# EAGLE design feedback_PCB (EAGLE 9.0.1)
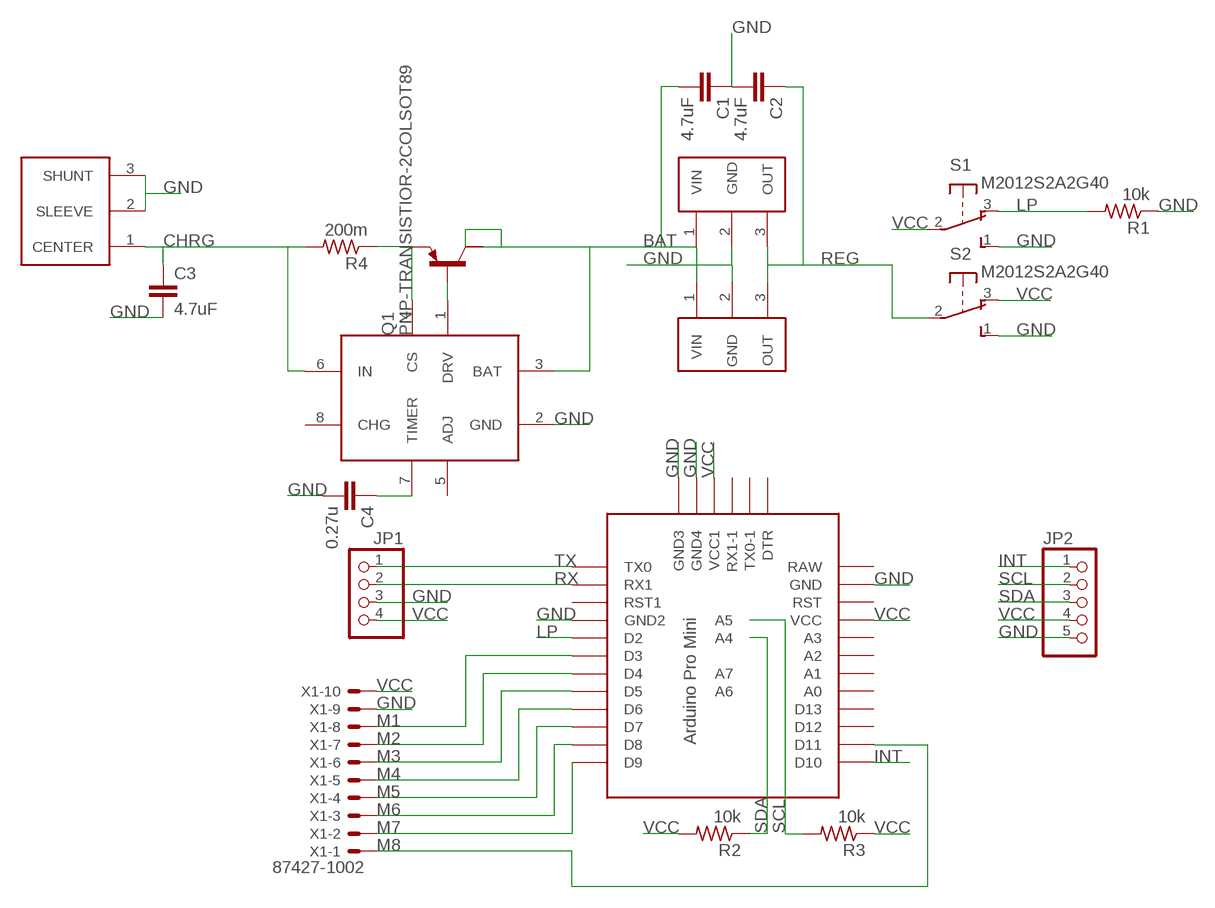
[diagram p0: schematic, sheet 1]

## Parts
C1  4.7uF  4.7UF0603  [0603]
C2  4.7uF  4.7UF0603  [0603]
C3  4.7uF  4.7UF0603  [0603]
C4  0.27u  0.33UF/330NF-0805-50V-10%  [0805]
JP1  PINHD-1X4  [1X04]
JP2  PINHD-1X5  [1X05]
Q1  PNP-TRANSISTIOR-2COLSOT89  [SOT89]
R1  10k  R-US_R0603  [R0603]
R2  10k  R-US_R0603  [R0603]
R3  10k  R-US_R0603  [R0603]
R4  200m  R-US_R0603  [R0603]
S1  M2012S2A2G40  [M2012S2A2G40]
S2  M2012S2A2G40  [M2012S2A2G40]
U2  ADP2291  [8-MSOP]
U$1  PRO-MINI-2  [PRO-MINI-2]
V1  UCC283T-3  [TO220V]
V2  UCC283T-3  [TO220V]
V3  L712RAS  [L712RAS]
X1  87427-1002  [87427-1002]

## Nets
BAT: C1.2 Q1.2(C) Q1.2@1(C/) U2.3(BAT) V1.1(VIN) V2.1(VIN)
CHRG: C3.1 R4.2 U2.6(IN) V3.1(CENTER)
CS: Q1.3(E) R4.1 U2.4(CS)
DRV: Q1.1(B) U2.1(DRV)
GND: C1.1 C2.2 C3.2 C4.2 JP1.3 JP2.5 R1.1 S1.1(S) S2.1(S) U2.2(GND) U$1.GND U$1.GND1(GND2) U$1.GND3(GND4) V1.2(GND) V2.2(GND) V3.2(SLEEVE) V3.3(SHUNT) X1.9
INT: JP2.1 U$1.D10
LP: R1.2 S1.3(O) U$1.D2
M1: U$1.D3 X1.8
M2: U$1.D4 X1.7
M3: U$1.D5 X1.6
M4: U$1.D6 X1.5
M5: U$1.D7 X1.4
M6: U$1.D8 X1.3
M7: U$1.D9 X1.2
M8: U$1.D11 X1.1
REG: C2.1 S2.2(P) V1.3(OUT) V2.3(OUT)
RX: JP1.2 U$1.RX1
SCL: JP2.2 R3.2 U$1.A5
SDA: JP2.3 R2.1 U$1.A4
TIMER: C4.1 U2.7(TIMER)
TX: JP1.1 U$1.TX0
VCC: JP1.4 JP2.4 R2.2 R3.1 S1.2(P) S2.3(O) U$1.VCC U$1.VCC1 X1.10
Unconnected: U2.5(ADJ) U2.8(CHG) U$1.A0 U$1.A1 U$1.A2 U$1.A3 U$1.A6 U$1.A7 U$1.D12 U$1.D13 U$1.DTR U$1.GND2(GND3) U$1.RAW U$1.RST U$1.RST1 U$1.RX1-1 U$1.TX0-1

## Library data of the parts
C1-C3 = SparkFun-Capacitors:4.7UF: 4.7µF ceramic capacitors A capacitor is a passive two-terminal electrical component used to store electrical energy temporarily in an electric field.; PROD_ID: CAP-08280
C4 = SparkFun-Capacitors:0.33UF/330NF: 0.33µF/330nF ceramic capacitors A capacitor is a passive two-terminal electrical component used to store electrical energy temporarily in an electric field.; PROD_ID: CAP-08469; VALUE: 0.33µF
JP1 = pinhead:PINHD-1X4: PIN HEADER
JP2 = pinhead:PINHD-1X5: PIN HEADER
Q1 = semicon-smd-ipc:PNP-TRANSISTIOR-2COL: PNP TRANSISTOR 2 colletor pins
R1-R4 = resistor:R-US_: RESISTOR, American symbol
S1 S2 = SeanSylwester:M2012S2A2G40: MARQUARDT SWITCH 9077.0100 Distributor: Buerklin <https://www.buerklin.com/default.asp?event=ShowArtikel%2812G2820%29&l=d&jump=ArtNr_12G2820>
U2 = SeanSylwester:ADP2291
U$1 = Arduino-clone:PRO-MINI-2: Arduino Pro Mini Layout 2 Sparkfun.com
V1 V2 = SeanSylwester:UCC283T-3
V3 = SeanSylwester:L712RAS
X1 = SeanSylwester:87427-1002: Mini FIT connector 10 pol Source: http://www.molex.com; MF: MOLEX; OC_FARNELL: unknown; OC_NEWARK: unknown

## Board
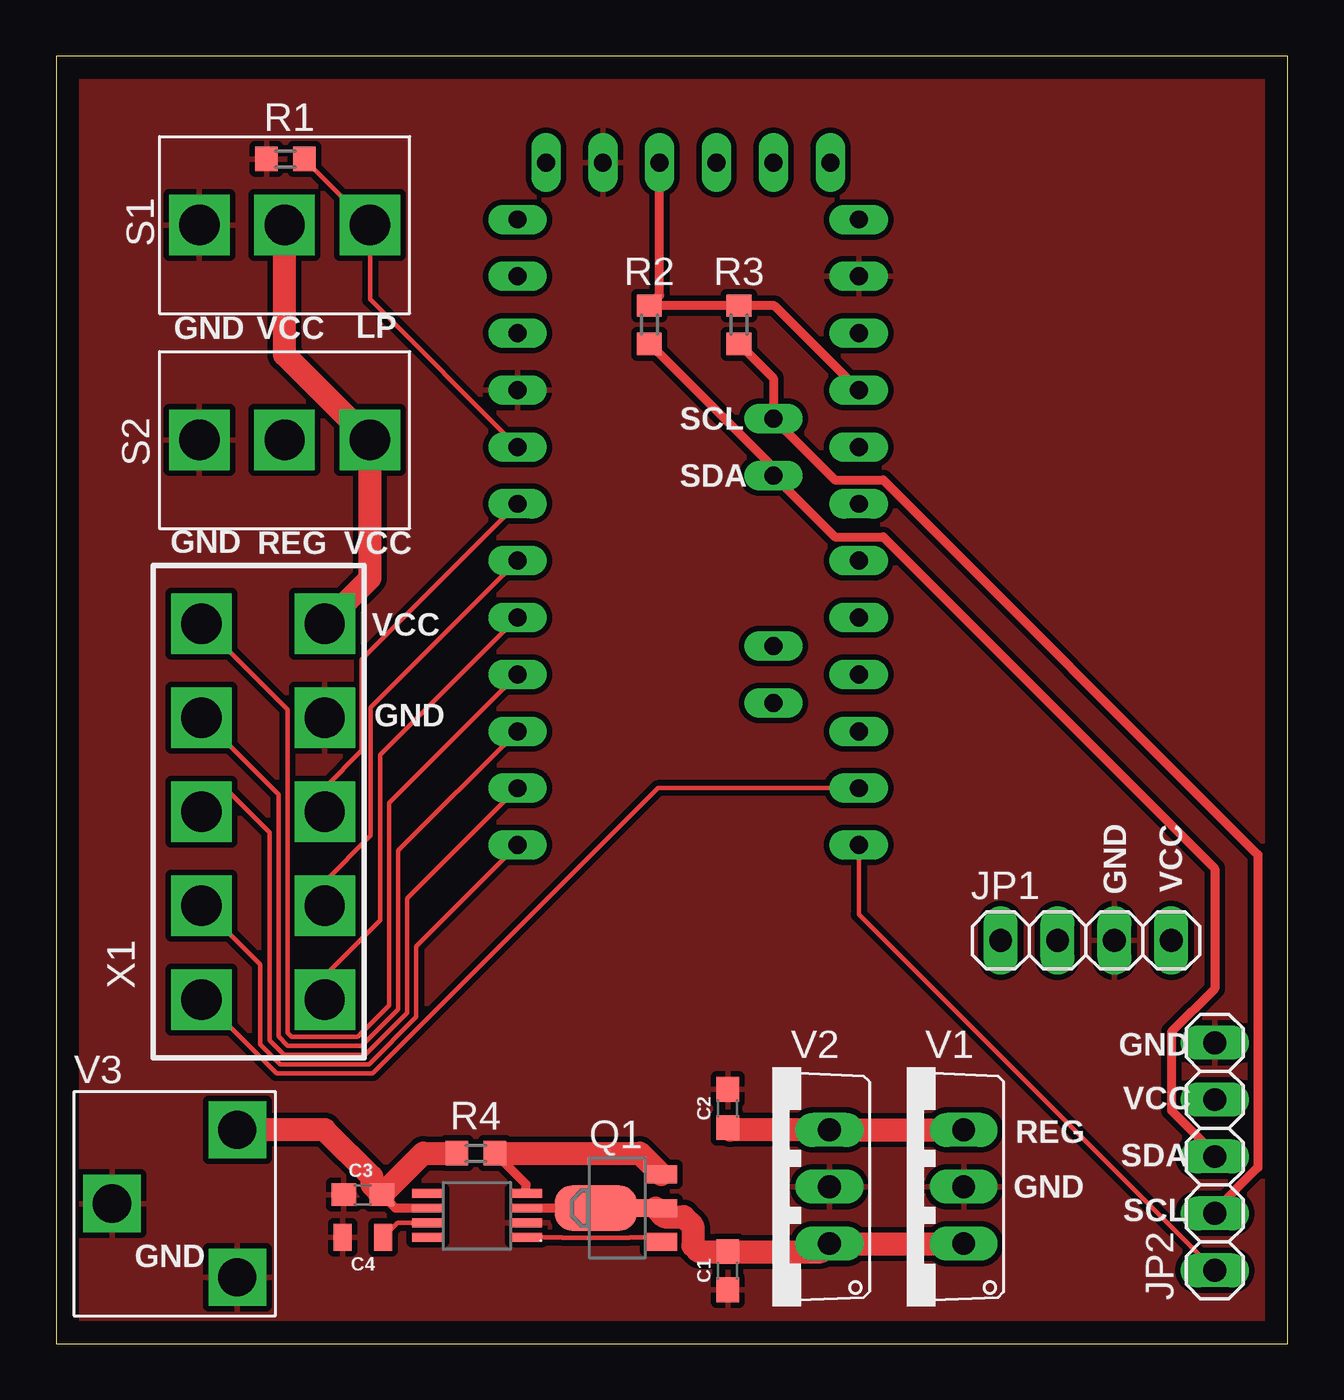
[diagram p1: board, top side]
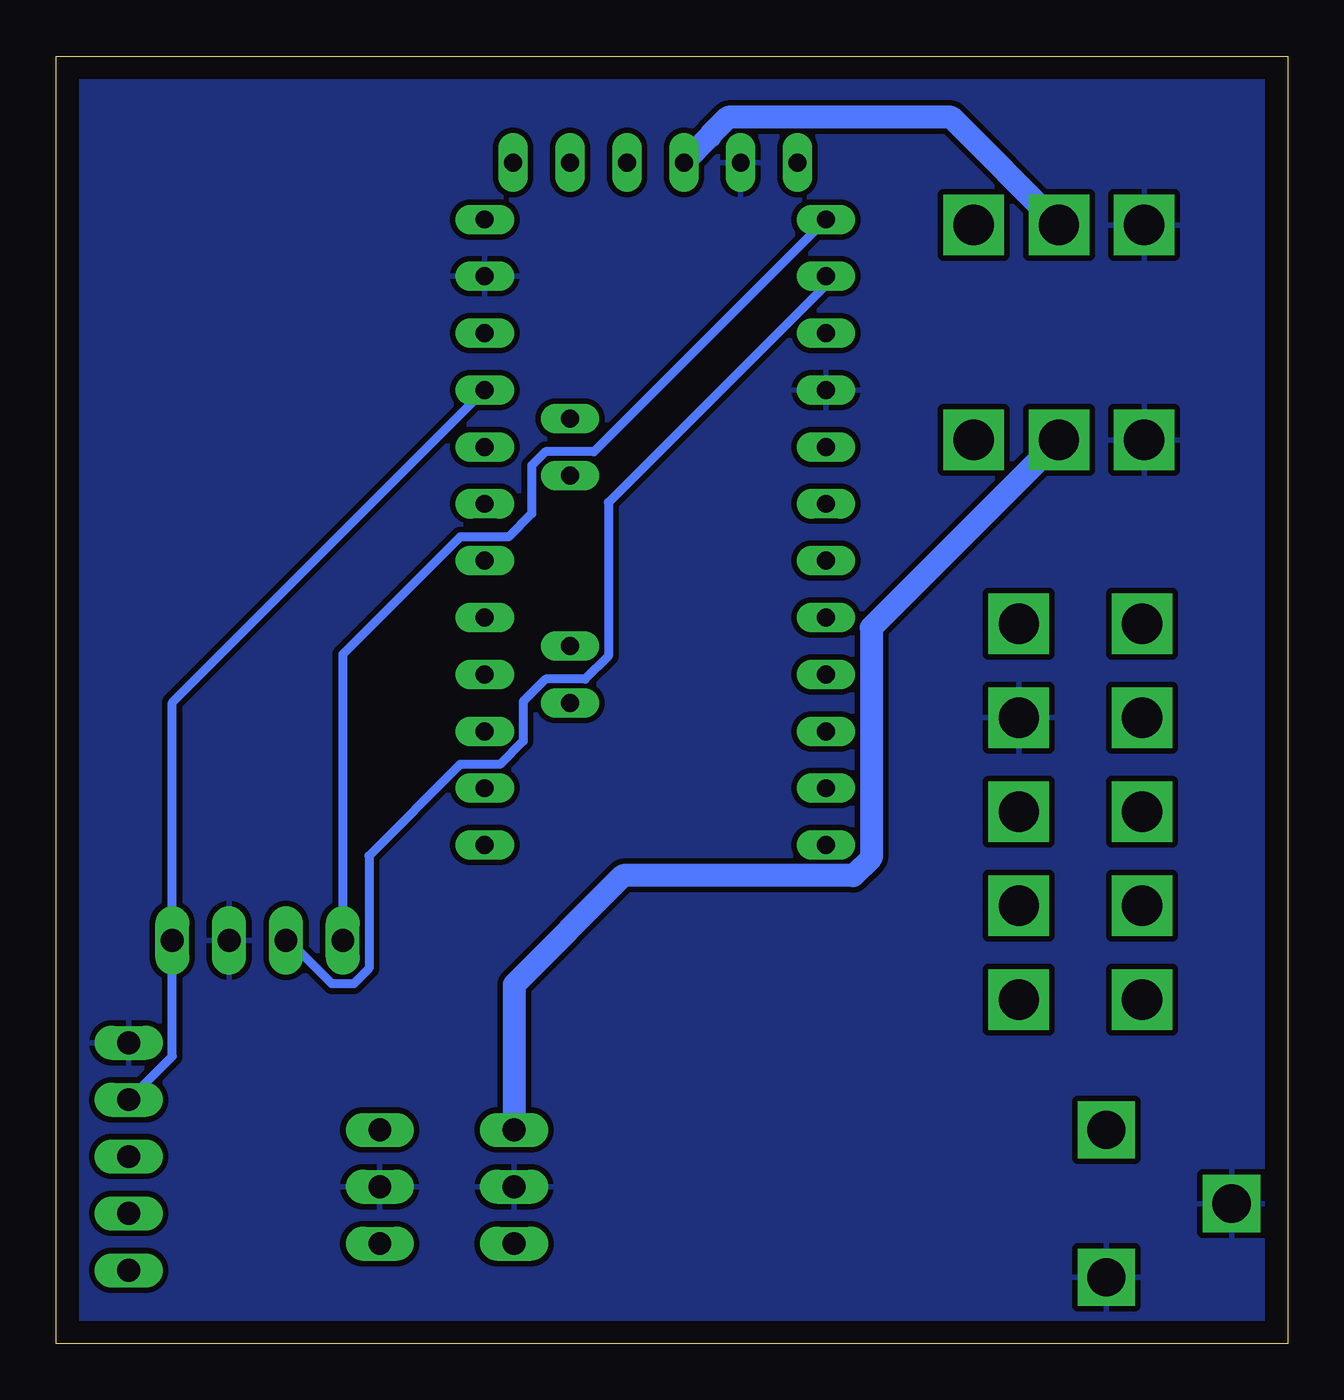
[diagram p2: board, bottom side, seen from below]

Size 55 x 57.5 mm. Coordinates in mm from the lower left corner, seen from the top.
Outline: 0,0 55,0 55,57.5 0,57.5 0,0
Copper layers (1*16): Top 0.035mm / dielectric 1.5mm / Bottom 0.035mm
Design rules "default *": minimum track width 8mil, minimum drill 0.35mm, track to track 8mil, track to pad 8mil, pad to pad 8mil, via to via 8mil, smd to smd 8mil, copper to edge 40mil, drill to drill 8mil, minimum pad ring 10mil, minimum via ring 8mil, stop-mask expansion 4mil, vias tented up to drill 0mil, thermal gap 10mil

### Footprints (pad centres in the part's own frame; a part is rotated, then mirrored left to right if it is on the bottom)
0603 = smd 1.1 x 1: 1 -0.85,0; 2 0.85,0
0805 = smd 0.8 x 1.2: 1 -0.9,0; 2 0.9,0
1X04 = drill 1.016 long: 1 -3.81,0; 2 -1.27,0; 3 1.27,0; 4 3.81,0
1X05 = drill 1.016 long: 1 -5.08,0; 2 -2.54,0; 3 0,0; 4 2.54,0; 5 5.08,0
SOT89 = smd 0.8 x 1.4: 1 -1.499,-1.981; 3 1.499,-1.981 | smd 0.8 x 1.9: 2 0,-1.727 | smd 2.032 x 3.65: 2@1 0,0.94
R0603 = smd 1 x 1.1: 1 -0.85,0; 2 0.85,0
M2012S2A2G40 = drill 1.8 square: 1 0,0; 2 3.81,0; 3 7.62,0
8-MSOP = smd 1.4 x 0.4: 1 0.8,2.25; 2 0.8,1.6; 3 0.8,0.95; 4 0.8,0.3; 5 5.2,0.3; 6 5.2,0.95; 7 5.2,1.6; 8 5.2,2.25
PRO-MINI-2 = drill 0.8 long: A0 6.35,2.54; A1 6.35,0; A2 6.35,-2.54; A3 6.35,-5.08; A4 2.54,1.27; A5 2.54,3.81; A6 2.54,-8.89; A7 2.54,-6.35; D2 -8.89,2.54; D3 -8.89,0; D4 -8.89,-2.54; D5 -8.89,-5.08; D6 -8.89,-7.62; D7 -8.89,-10.16; D8 -8.89,-12.7; D9 -8.89,-15.24; D10 6.35,-15.24; D11 6.35,-12.7; D12 6.35,-10.16; D13 6.35,-7.62; DTR 5.08,15.24; GND 6.35,10.16; GND1 -8.89,5.08; GND2 -7.62,15.24; GND3 -5.08,15.24; RAW 6.35,12.7; RST 6.35,7.62; RST1 -8.89,7.62; RX1 -8.89,10.16; RX1-1 0,15.24; TX0 -8.89,12.7; TX0-1 2.54,15.24; VCC 6.35,5.08; VCC1 -2.54,15.24
TO220V = drill 1.016 long: 1 -2.54,-2.54; 2 0,-2.54; 3 2.54,-2.54
L712RAS = drill 1.7 square: 1 5.6,3.3; 2 0,0; 3 5.6,-3.3
87427-1002 = drill 1.8 square: 1 8.4,0; 2 4.2,0; 3 0,0; 4 -4.2,0; 5 -8.4,0; 6 8.4,5.5; 7 4.2,5.5; 8 0,5.5; 9 -4.2,5.5; 10 -8.4,5.5

### Placement (x,y rotation side)
C1  30,3.25 90 top
C2  30,10.5 90 top
C3  13.7,6.65 180 top
C4  13.7,4.75 180 top
JP1  46,18 0 top
JP2  51.75,8.35 90 top
Q1  25.05,6.05 90 top
R1  10.25,52.9 0 top
R2  26.5,45.5 90 top
R3  30.5,45.5 270 top
R4  18.75,8.5 180 top
S1  6.4,49.95 0 top
S2  6.4,40.35 0 top
U2  21.8,7 180 top
U$1  29.5,37.5 0 top
V1  38,7 90 top
V2  32,7 90 top
V3  2.5,6.25 0 top
X1  6.5,23.75 270 top

### Tracks (layer width: path | path; a pad name or v marks a point on that pad's centre or on a via)
BAT
  Top 0.406: U2.3 Q1.2@1 Q1.2
  Top 1.016: Q1.2 27.16,5.66 28.03,5.66 28.44,5.25 28.44,4.38 28.73,4.1 C1.2 34.18,4.1 V2.1 V1.1
CHRG
  Top 0.406: C3.1 15.15,6.05 U2.6
  Top 1.016: R4.2 16.4,8.5 C3.1 14.11,7.09 14.11,7.45 12.01,9.55 V3.1
CS
  Top 0.406: U2.4 21,7.1 R4.1
  Top 1.016: R4.1 26.08,8.5 Q1.3
DRV
  Top 0.203: Q1.1 26.83,4.75 25.64,4.75 25.61,4.73 22.61,4.73 22.58,4.75 U2.1
GND
  pour Bottom (isolate 0.254): 0,0 55,0 55,57.5 0,57.5
  pour Top (isolate 0.254): 0,0 55,0 55,57.5 0,57.5
INT
  Top 0.203: U$1.D10 35.85,19.17 JP2.1
LP
  Top 0.203: R1.2 11.1,52.87 S1.3 14.02,46.63 U$1.D2
M1
  Top 0.203: U$1.D3 13.65,30.55 13.65,26.47 12,24.82 X1.8
M2
  Top 0.203: U$1.D4 14.06,28.41 14.06,22.68 12,20.62 X1.7
M3
  Top 0.203: U$1.D5 14.47,26.28 14.47,18.89 12,16.42 X1.6
M4
  Top 0.203: U$1.D6 14.87,24.14 14.87,15.09 13.48,13.7 10.52,13.7 10.35,13.87 10.35,28.3 X1.5
M5
  Top 0.203: U$1.D7 15.28,22.01 15.28,14.93 13.64,13.29 10.36,13.29 9.94,13.71 9.94,24.51 X1.4
M6
  Top 0.203: X1.3 7.55,24.8 9.53,22.82 9.53,13.54 10.19,12.88 13.81,12.88 15.69,14.76 15.69,19.88 U$1.D8
M7
  Top 0.203: X1.2 9.13,16.92 9.13,13.37 10.02,12.48 13.98,12.48 16.09,14.59 16.09,17.74 U$1.D9
M8
  Top 0.203: X1.1 6.57,15.35 9.85,12.07 14.15,12.07 26.88,24.8 U$1.D11
REG
  Top 1.016: V1.3 V2.3 30.11,9.54 C2.1
  Bottom 1.016: V2.3 34.54,16.02 29.66,20.89 19.39,20.89 18.59,21.7 18.59,31.97 S2.2
RX
  Bottom 0.406: U$1.RX1 20.61,47.27 30.33,37.56 30.33,30.71 31.37,29.67 33.13,29.67 34.14,28.67 34.14,26.9 35.18,25.86 36.94,25.86 41.02,21.78 41.02,16.75 41.71,16.07 42.67,16.07 44.6,18 JP1.2
SCL
  Top 0.406: R3.2 32.04,43.11 U$1.A5 34.79,38.56 36.94,38.56 53.68,21.82 53.68,7.87 51.75,5.94 JP2.2
SDA
  Top 0.406: R2.1 32.04,39.11 U$1.A4 34.79,36.02 36.94,36.02 51.75,21.21 51.75,15.84 49.82,13.91 49.82,10.41 51.75,8.48 JP2.3
TIMER
  Top 0.203: C4.1 15.25,5.4 U2.7
TX
  Bottom 0.406: U$1.TX0 30.98,39.83 33.13,39.83 33.75,39.21 33.75,37.06 34.79,36.02 36.94,36.02 42.19,30.77 JP1.1
VCC
  Top 0.406: U$1.VCC1 26.96,46.81 R2.2 R3.1 32.08,46.35 U$1.VCC
  Top 1.016: S1.2 10.21,44.16 S2.3 14.02,34.17 X1.10
  Bottom 0.406: JP2.4 49.81,12.83 JP1.4 49.81,28.62 U$1.VCC
  Bottom 1.016: U$1.VCC1 25.79,53.91 25.79,53.96 24.98,54.76 15.02,54.76 S1.2

### Text on the board
tPlace: GND | VCC | LP | SCL | SDA | GND | REG | VCC | VCC | GND | GND | VCC | GND | VCC | REG | SDA | GND | SCL | GND